# Altium schematic sheet J-Link Cortex with VCOM Adapter.SchDoc
size Letter; Address4: USA
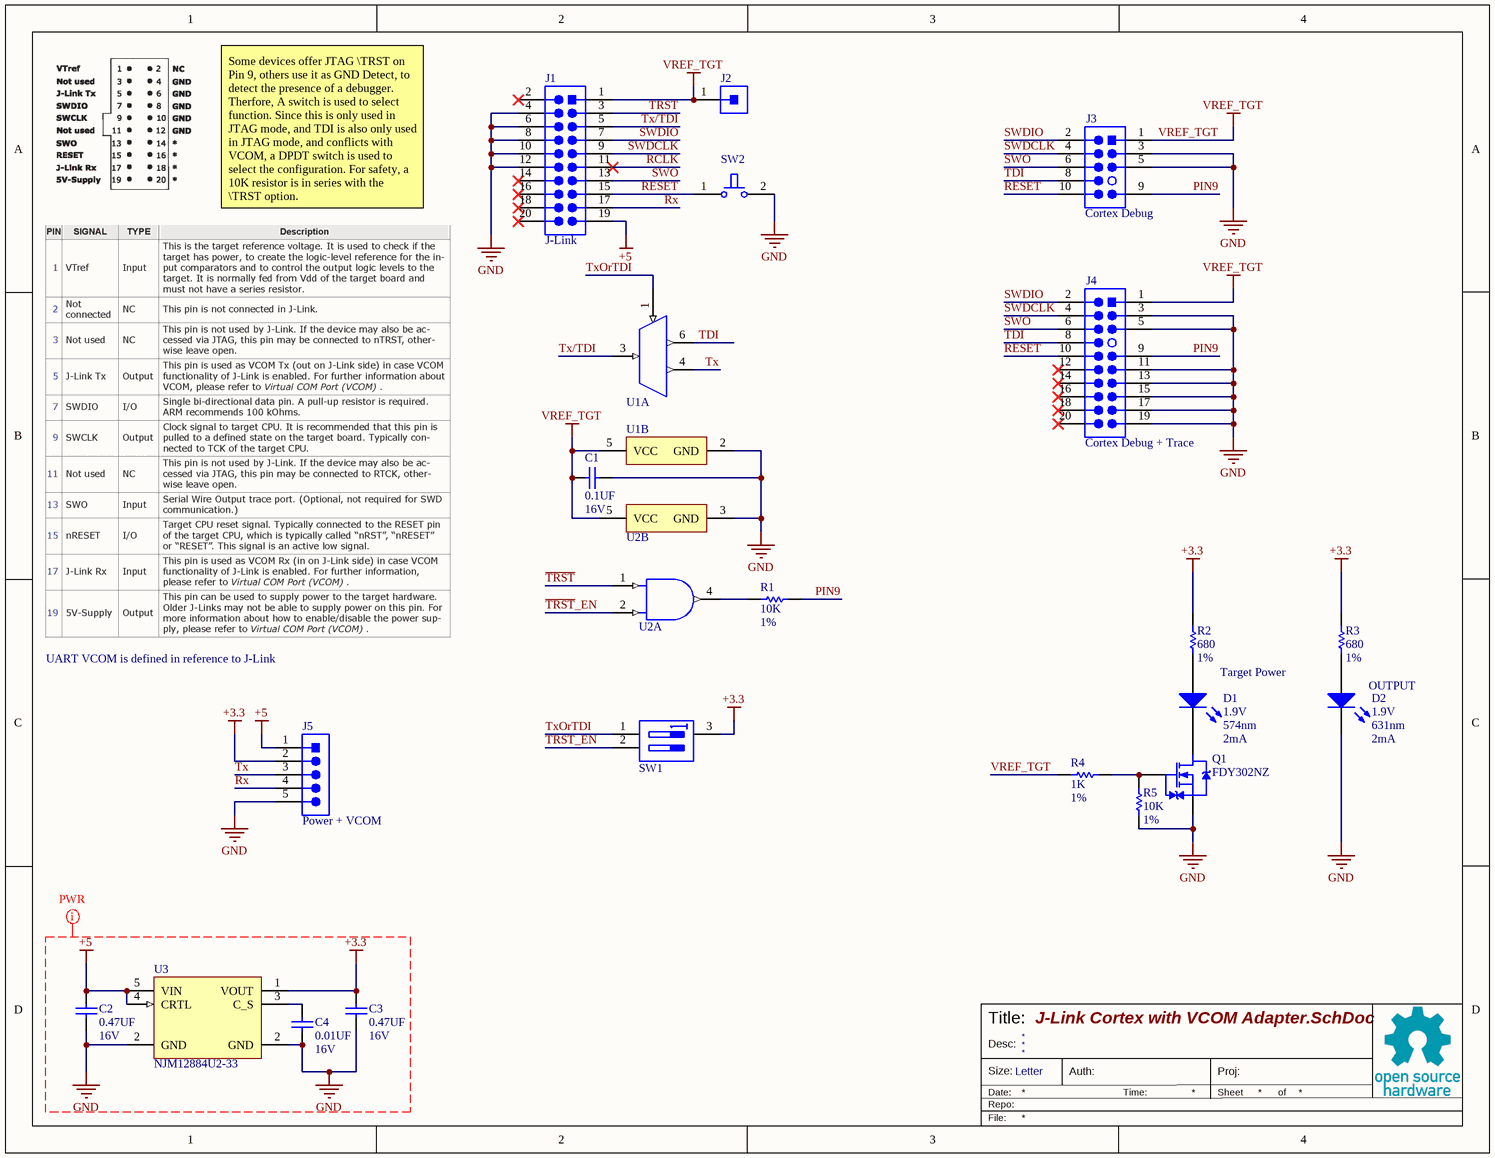
[diagram p0: J-Link Cortex with VCOM Adapter.SchDoc]

## Parts
C1  Val: 0.1UF  Vol: 16V  [0603_CAP]  (hidden comment: CAP 0603 0.1UF 16V 10% X7R)
C2  Val: 0.47UF  Vol: 16V  [0603_CAP]  (hidden comment: CAP 0603 0.47UF 16V 10% X7R)
C3  Val: 0.47UF  Vol: 16V  [0603_CAP]  (hidden comment: CAP 0603 0.47UF 16V 10% X7R)
C4  Val: 0.01UF  Vol: 16V  [0603_CAP]  (hidden comment: CAP 0603 0.01UF 16V 10% X7R)
D1  Voltage Rating: 1.9V  Wavelength: 574nm  Test Current: 2mA  [SM0805GCL]  (hidden comment: Green LED)
D2  Voltage Rating: 1.9V  Wavelength: 631nm  Test Current: 2mA  [SM0805HCL]  (hidden comment: Red LED)
J1  20 contact Female header, RA  [SFH11-PBPC-D10-RA-BK]  (value not drawn)
J2  1 contacts Male header  [PH1-01-UA round pad with connector]  (value not drawn)
J3  Cortex Debug, 0.050" 10 Pin  [FTSH-105-01-F-DV-007-K PLUGOUT]  (value not drawn)
J4  Cortex Debug+ETM Connector, 0.050" 20 Pin  [FTSH-110-01-F-DV-007-K plugout]  (value not drawn)
J5  5 contacts Male header  [70543-0109 - slim]  (value not drawn)
Q1  Manufacturer P/N: FDY302NZ  [SC89]  (hidden comment: N-Channel MOSFET)
R1  Val: 10K  Tol: 1%  [0603_RES]  (hidden comment: RES 0603 10K 1%)
R2  Val: 680  Tol: 1%  [0603_RES]  (hidden comment: RES 0603 680 1%)
R3  Val: 680  Tol: 1%  [0603_RES]  (hidden comment: RES 0603 680 1%)
R4  Val: 1K  Tol: 1%  [0603_RES]  (hidden comment: RES 0603 1K 1%)
R5  Val: 10K  Tol: 1%  [0603_RES]  (hidden comment: RES 0603 10K 1%)
SW1  SWITCH SLIDE DIP SPST 10MA 20V  [SPA02B]  (value not drawn)
SW2  SWITCH TACTILE SPST-NO 0.02A 15V  [EVP-BB2A9B000 LOW DENSITY]  (value not drawn)
U1  Demultiplexer  [SOT363]  (value not drawn)  (parts A,B of 2)
U2  Single AND Gate  [SOT353]  (value not drawn)  (parts A,B of 2)
U3  P/N: NJM12884U2-33  [SOT89-5_NJR]  (hidden comment: 3.3V LDO Soft start reverse current reverse voltage)

## Nets
+3.3: C3.2 J5.2 R2.2 R3.2 SW1.3(COM) U3.1(VOUT)
+5: C2.2 J1.19 J5.1 U3.4(CRTL) U3.5(VIN)
GND: C1.2 C2.1 C3.1 C4.1 D2.K J1.4 J1.6 J1.8 J1.10 J1.12 J3.3(GND) J3.5(GND) J4.3(GND) J4.5(GND) J4.11(GND/TgtPwr+Cap) J4.13 J4.15(GND) J4.17(GND) J4.19(GND) J5.5 Q1.2(S) R5.1 SW2.2 U1.2(GND) U2.3(GND) U3.2(GND)
VREF_TGT: C1.1 J1.1 J2.1 J3.1(VCC) J4.1(VCC) R4.1 U1.5(VCC) U2.5(VCC)
~{RESET}: J1.15 J3.10(~{RESET}) J4.10(~{RESET}) SW2.1
~{TRST}: J1.3 U2.1(A)
PIN9: J3.9(GNDDetect) J4.9(GNDDetect) R1.1
RCLK: J1.11
Rx: J1.17 J5.4
SWDCLK: J1.9 J3.4(SWDCLK/TCK) J4.4(SWDCLK/TCK)
SWDIO: J1.7 J3.2(SWDIO/TMS) J4.2(SWDIO/TMS)
SWO: J1.13 J3.6(SWO/TDO) J4.6(SWO/TDO/EXTa/TRACECTL)
~{TRST}_EN: SW1.2 U2.2(B)
TDI: J3.8(NC/TDI) J4.8(NC/EXTb/TDI) U1.6(Y0)
Tx: J5.3 U1.4(Y1)
Tx/TDI: J1.5 U1.3(A)
TxOrTDI: SW1.1 U1.1(S)
NetC4_2: C4.2 U3.3(C_S)
NetD1_A: D1.A R2.1
NetD1_K: D1.K Q1.3(D)
NetD2_A: D2.A R3.1
NetQ1_1: Q1.1(G) R4.2 R5.2
NetR1_2: R1.2 U2.4(Y)

Not connected (* = marked no-connect by the designer): J1 2* 14* 16* 18* 20*; J4 12(TRACECLK)* 14(TRACEDATA[0])* 16(TRACEDATA[1])* 18(TRACEDATA[2])* 20(TRACEDATA[3])*

## Layout directives
net class PWR: +3.3, +5, GND

## Notes on the sheet
- Some devices offer JTAG \TRST on Pin 9, others use it as GND Detect, to detect the presence of a debugger. Therfore, A switch is used to select function. Since this is only used in JTAG mode, and TDI is also only used in JTAG mode, and conflicts with VCOM, a DPDT switch is used to select the configuration. For safety, a 10K resistor is in series with the \TRST option.
- (near J3) Cortex Debug
- (near J1) J-Link
- (near J4) Cortex Debug + Trace
- UART VCOM is defined in reference to J-Link
- Target Power
- OUTPUT
- (near J5) Power + VCOM
- Title:
- Desc:
- Size:
- Date:
- File:
- Repo:
- Letter
- Auth:
- Time:
- Sheet
- Proj:
- of

## Library data of the parts
C1 = CAP 0603 0.1UF 16V 10% X7R: Capacitor Surface Mount 0603 Footprint 0.1UF 16V 10% Tolerance Ceramic X7R; Manufacturer: Various; PCB Package: 0603; Description in Visual: Cap SMT 0603 0.1UF 16V 10%  Cer X7R; P/N: CAP 0603 0.1UF 16V 10% X7R; Manufacturer P/N: Various; Value: 0.1UF; Voltage: 16V; Tolerance: 10%; Type: Ceramic X7R; ComponentLink1Description: Manufacturer Website; ComponentLink2Description: Component Datasheet; ComponentLink3Description: Octopart Link
C2 C3 = CAP 0603 0.47UF 16V 10% X7R: Capacitor Surface Mount 0603 Footprint 0.47UF 16V 10% Tolerance Ceramic X7R; Manufacturer: Various; PCB Package: 0603; Description in Visual: Cap SMT 0603 0.47UF 16V 10%  Cer X7R; P/N: CAP 0603 0.47UF 16V 10% X7R; Manufacturer P/N: Various; Value: 0.47UF; Voltage: 16V; Tolerance: 10%; Type: Ceramic X7R; ComponentLink1Description: Manufacturer Website; ComponentLink2Description: Component Datasheet; ComponentLink3Description: Octopart Link
C4 = CAP 0603 0.01UF 16V 10% X7R: Capacitor Surface Mount 0603 Footprint 0.01UF 16V 10% Tolerance Ceramic X7R; Manufacturer: Various; PCB Package: 0603; Description in Visual: Cap SMT 0603 0.01UF 16V 10%  Cer X7R; P/N: CAP 0603 0.01UF 16V 10% X7R; Manufacturer P/N: Various; Value: 0.01UF; Voltage: 16V; Tolerance: 10%; Type: Ceramic X7R; ComponentLink1Description: Manufacturer Website; ComponentLink2Description: Component Datasheet; ComponentLink3Description: Octopart Link
D1 = SM0805GCL: Green 574nm LED Indication - Discrete 1.9V 0805 (2012 Metric); Manufacturer: Bivar; PCB Package: 0805; Configuration: Single; Lens Style: Square; Millicandela Rating: 3.6mcd; Viewing Angle: 130°; Lens Type: Clear; Package Class: Surface Mount; P/N: SM0805GCL; Manufacturer P/N: SM0805GCL; Description in Visual: Green 574nm LED Indication - Discrete 1.9V 0805 (2012 Metric); Color: Green; ComponentLink1Description: Manufacturer Website; ComponentLink1URL: #https://www.bivar.com/#; ComponentLink2Description: Component Datasheet; ComponentLink2URL: https://www.bivar.com/parts_content/Datasheets/SM0805HCL.pdf; ComponentLink3Description: Octopart Link; ComponentLink3URL: #https://octopart.com/sm0805gcl-bivar-22059573?r=sp#
D2 = SM0805HCL: Red 631nm LED Indication - Discrete 1.9V 0805 (2012 Metric); Manufacturer: Bivar; PCB Package: 0805; Configuration: Single; Lens Style: Square; Millicandela Rating: 11.5mcd; Viewing Angle: 130°; Lens Type: Clear; Package Class: Surface Mount; P/N: SM0805HCL; Manufacturer P/N: SM0805HCL; Description in Visual: Red 631nm LED Indication - Discrete 1.9V 0805 (2012 Metric); Color: Red; ComponentLink1Description: Manufacturer Website; ComponentLink1URL: #https://www.bivar.com/#; ComponentLink2Description: Component Datasheet; ComponentLink2URL: https://www.bivar.com/parts_content/Datasheets/SM0805HCL.pdf; ComponentLink3Description: Octopart Link; ComponentLink3URL: #https://octopart.com/sm0805hcl-bivar-2191581?r=sp#
J1 = SFH11-PBPC-D10-RA-BK: 20 Position Header Connector  Through Hole, Right Angle; Manufacturer: Sullins; PCB Package: 2x10 THT; Description in Visual: Con Hdr Female 20 contacts horizontal 2X10 keyed; Number of Contacts: 20; Pitch: 0.100"; P/N: SFH11-PBPC-D10-RA-BK; Manufacturer P/N: SFH11-PBPC-D10-RA-BK; Orientation: horizontal; Number of Rows: 2; ComponentLink1Description: Manufacturer Website; ComponentLink1URL: https://www.sullinscorp.com/; ComponentLink2Description: Component Datasheet; ComponentLink2URL: https://datasheet.ciiva.com/754/sfh11-pxxc-dxx-ra-xx11161-c-754566.pdf?src-supplier=Digi-Key; Supplier 1: Digi-Key; Supplier Part Number 1: S9205-ND
J2 = PH1-01-UA: Connector Male Header 1X1 vertical 1contact 0.100in pitch Gold finish TH; Manufacturer: Adam Tech; PCB Package: NON-STD TH; Description in Visual: Con Hdr Male 1contacts vertical 1X1; Number of Contacts: 1; P/N: PH1-01-UA; Manufacturer P/N: PH1-01-UA; Orientation: vertical; Number of Rows: 1; Pitch: 0.100in; Contact Finish: Gold Flash; Gender: Male; ComponentLink1Description: Manufacturer Website; ComponentLink1URL: http://www.adam-tech.com/; ComponentLink2Description: Component Datasheet; ComponentLink2URL: http://www.adam-tech.com/downloader.php?p=PH1-XX-UA.pdf; ComponentLink3Description: Octopart Link; ComponentLink3URL: https://octopart.com/ph1-01-ua-adam+tech-12701205?r=sp; Supplier 1: Digi-Key; Supplier Part Number 1: 2057-PH1-01-UA-ND
J3 = ARM Cortex Debug: 10 Pin Shrouded Header, 0.050", Key Pin 7; Manufacturer: Samtech; Manufacturer P/N: Various; Number of Contacts: 10; Gender: Male; P/N: ARM Cortex Debug; Description in Visual: 10 Pin Shrouded Header, 0.050", Key Pin 7; Orientation: Vertical; Number of Rows: 2; Pitch: 0.050"; Contact Finish: Gold; ComponentLink1Description: Pinout Reference; ComponentLink1URL: http://infocenter.arm.com/help/topic/com.arm.doc.faqs/attached/13634/cortex_debug_connectors.pdf; Supplier 3: Digi-Key; Supplier Part Number 3: SAM11250-ND; Supplier 1: Digi-Key; Supplier Part Number 1: SAM15640-ND; Supplier 2: Digi-Key; Supplier Part Number 2: SAM13926CT-ND; ComponentLink2Description: Datasheet for Connector; ComponentLink2URL: http://suddendocs.samtec.com/catalog_english/ftsh_smt.pdf
J4 = Cortex Debug+ETM: 20 Pin Shrouded Header, 0.050", Key Pin 7; Manufacturer: Samtech; Manufacturer P/N: Various; Number of Contacts: 20; Gender: Male; P/N: Cortex Debug+ETM; Description in Visual: 20 Pin Shrouded Header, 0.050", Key Pin 7; Orientation: Vertical; Number of Rows: 2; Pitch: 0.050"; Contact Finish: Gold; ComponentLink1Description: Pinout Reference; ComponentLink1URL: http://infocenter.arm.com/help/topic/com.arm.doc.faqs/attached/13634/cortex_debug_connectors.pdf; Supplier 3: Digi-Key; Supplier Part Number 3: SAM11264-ND; Supplier 4: Avnet; Supplier Part Number 4: FTSH-110-01-F-DV-007-K-A; Supplier 1: Digi-Key; Supplier Part Number 1: SAM15422CT-ND; Supplier 2: Avnet; Supplier Part Number 2: FTSH-110-01-F-DV-007-K-TR; ComponentLink2Description: Datasheet for Connector; ComponentLink2URL: http://suddendocs.samtec.com/catalog_english/ftsh_smt.pdf
J5 = 70543-0109: Connector Male Header 1X5 vertical 5contacts 0.100in pitch 0.76um Gold finish shrouded with latch; Manufacturer: Molex; PCB Package: NON-STD TH; Description in Visual: Con Hdr Male 5contacts vertical 1X5; Number of Contacts: 5; P/N: 70543-0109; Manufacturer P/N: 70543-0109; Orientation: vertical; Number of Rows: 1.00; Pitch: 0.100in; Contact Finish: 0.76um Gold; Gender: Male; Options: shrouded with latch; ComponentLink1Description: Manufacturer Website; ComponentLink1URL: http://www.molex.com; ComponentLink2Description: Component Datasheet; ComponentLink2URL: http://www.molex.com/pdm_docs/sd/705430106_sd.pdf; ComponentLink4Description: Product Page; ComponentLink4URL: http://www.molex.com/molex/products/datasheet.jsp?part=active/0705430109_PCB_HEADERS.xml; ComponentLink3Description: Octopart Link; ComponentLink3URL: http://octopart.com/partsearch/#search/requestData&q=70543-0109; Supplier 1: Digi-Key; Supplier Part Number 1: WM4125-ND
Q1 = FDY302NZ: N-Channel 20V 600mA (Ta) 625mW (Ta) Surface Mount SC-89; Manufacturer: On Semiconductor; Vdss (V): 20; RDSon (mOhms): 300; ID (Amps): 0.6; Rth(JC) (K/W): 280; P/N: FDY302NZ; PCB Package: SC-89; Description in Visual: N-Channel 20V 600mA (Ta) 625mW (Ta) Surface Mount SC-89; Family: FDY30; Package Class: Surface Mount; ComponentLink1Description: Manufacturer Website; ComponentLink1URL: #https://www.onsemi.com#; ComponentLink2Description: Component Datasheet; ComponentLink2URL: https://www.onsemi.com/pub/Collateral/FDY302NZ-D.pdf; ComponentLink4Description: Product Page; ComponentLink4URL: https://www.onsemi.com/products/discretes-drivers/mosfets/fdy302nz; ComponentLink3Description: Octopart Link; ComponentLink3URL: #https://octopart.com/fdy302nz-on+semiconductor-84326732?r=sp#; Supplier 1: Digi-Key; Supplier Part Number 1: FDY302NZCT-ND
R1 R5 = RES 0603 10K 1%: Resistor Surface Mount, 10K Ohms, 0603 Footprint, 1% Tolerance 0.1W; Manufacturer: Various; PCB Package: 0603; Description in Visual: Res SMT 10K 0603  1%  0.1W; P/N: RES 0603 10K 1%; Manufacturer P/N: Various; Value: 10K; Power_Rating: 0.1W; Tolerance: 1%; Supplier 1: Digi-Key; Supplier Part Number 1: P10.0KHCT-ND; Supplier 2: Digi-Key; Supplier Part Number 2: 541-10.0KHCT-ND; Supplier 3: Newark; Supplier Part Number 3: 68R0128; Supplier 4: Digi-Key; Supplier Part Number 4: A106048CT-ND
R2 R3 = RES 0603 680 1%: Resistor Surface Mount, 680 Ohms, 0603 Footprint, 1% Tolerance 0.1W; Manufacturer: Various; PCB Package: 0603; Description in Visual: Res SMT 680 0603  1%  0.1W; Value: 680; P/N: RES 0603 680 1%; Manufacturer P/N: Various; Power_Rating: 0.1W; Tolerance: 1%; Supplier 1: Digi-Key; Supplier Part Number 1: 541-680HCT-ND; Supplier 2: Digi-Key; Supplier Part Number 2: 2019-RK73H1JTTD6800FCT-ND; Supplier 3: Digi-Key; Supplier Part Number 3: P680HCT-ND; Supplier 4: Digi-Key; Supplier Part Number 4: YAG3356CT-ND
R4 = RES 0603 1K 1%: Resistor Surface Mount, 1K Ohms, 0603 Footprint, 1% Tolerance 0.1W; Manufacturer: Various; PCB Package: 0603; Description in Visual: Res SMT 1K 0603  1%  0.1W; P/N: RES 0603 1K 1%; Manufacturer P/N: Various; Value: 1K; Power_Rating: 0.1W; Tolerance: 1%; Supplier 1: Digi-Key; Supplier Part Number 1: 2019-RK73H1JTTD1001FCT-ND; Supplier 2: Digi-Key; Supplier Part Number 2: 541-1166-1-ND; Supplier 3: RSComponents; Supplier Part Number 3: 1051155; Supplier 4: Digi-Key; Supplier Part Number 4: 311-1.00KHRCT-ND
SW1 = SPA02B: Dip Switch SPST 2 Position Through Hole Slide (Standard) Actuator 10mA 20VDC, Commoned; Manufacturer: C&K; Number of Switches: 2; Mechanical Life: 1,000 Cycles; Electrical Life: 1000 Cycles; Throw Configuration: 2xSPST; Switch Function: Off-On (Common); Actuator Height: Flush/Recessed; P/N: SPA02B; Type: DIP; Rated Current (A): 10mA; Rated Voltage (V): 20VDC; Temperature Range: -30°C ~ 60°C; Mounting Style: Through Hole; Contact Material: Beryllium Copper. Gold Finish; ComponentLink1Description: Manufacturer's Website; ComponentLink1URL: https://www.ckswitches.com/; ComponentLink2Description: Component Datasheet; ComponentLink2URL: https://www.ckswitches.com/media/1325/spa.pdf; ComponentLink4Description: Octopart Link; ComponentLink4URL: https://octopart.com/spa02b-c%26k+components-7950389?r=sp; Supplier 1: Digi-Key; Supplier Part Number 1: CKN9438-ND; Manufacturer P/N: SPA02B
SW2 = EVP-BB2A9B000: Tactile Switch SPST-NO Top Actuated Surface Mount; Manufacturer: Panasonic Electronic Components; Number of Switches: 1; Rated Current (A): 20mA; Rated Voltage (V): 15VDC; Mechanical Life: 500,000 Cycles; Switch Function: Off-Mom; Actuator Height: 0.53mm; Actuation Force: 160gf; P/N: EVP-BB2A9B000; Manufacturer P/N: EVP-BB2A9B000; Type: Tactile; Temperature Range: -40°C ~ 85°C; Mounting Style: SMD; Throw Configuration: SPST-NO; ComponentLink1Description: Manufacturer's Website; ComponentLink1URL: https://na.industrial.panasonic.com/; ComponentLink2Description: Component Datasheet; ComponentLink2URL: https://www3.panasonic.biz/ac/e_download/control/switch/light-touch/catalog/sw_lt_eng_2616s.pdf; ComponentLink4Description: Octopart Link; ComponentLink4URL: https://octopart.com/evp-bb2a9b000-panasonic-75477754?r=sp; Supplier 1: Digi-Key; Supplier Part Number 1: P19888CT-ND
U1 = SN74LVC1G18DCK: Single 1-of-2 Non-Inverting Demultiplexer with 3-State Deselected Output SC70-6; Manufacturer: Texas Instruments; Description in Visual: Logic IC SMT Non-Inverting Demux SC70-6; Number of Gates: 1; Vs (min) (V): 1.65; Vs (max) (V): 5.5; Temp Range: -40 to +85 °C; P/N: SN74LVC1G18DCK; Manufacturer P/N: SN74LVC1G18DCK; Type: Demux; PCB Package: SC70-6; ComponentLink1Description: Manufacturer Website; ComponentLink1URL: http://www.ti.com; ComponentLink2Description: Component Datasheet; ComponentLink3Description: Octopart Link; ComponentLink3URL: http://octopart.com/partsearch/#search/requestData&q=SN74LVC1G18DCK; Supplier 1: Digi-Key; Supplier Part Number 1: 296-15569-1-ND
U2 = SN74LVC1G08DCKR: Single Positive-AND Gate SMT 2-Input SOT-353; Manufacturer: Texas Instruments; Description in Visual: Logic IC SMT Single AND Gate SOT-353; Number of Gates: 1; Number of Gate Inputs: 2; Vs (min) (V): 1.65; Vs (max) (V): 5.5; Quiescent Current (typ) (mA): 0.010; Temp Range: -40 to +125 °C; P/N: SN74LVC1G08DCKR; Manufacturer P/N: SN74LVC1G08DCKR; Type: AND; PCB Package: SOT353; ComponentLink1Description: Manufacturer Website; ComponentLink1URL: http://www.ti.com; ComponentLink2Description: Component Datasheet; ComponentLink2URL: https://www.ti.com/lit/ds/symlink/sn74lvc1g08.pdf; ComponentLink3Description: Octopart Link; ComponentLink3URL: #https://octopart.com/sn74lvc1g08dckr-texas+instruments-464430?r=sp#; Supplier 1: Digi-Key; Supplier Part Number 1: 296-11602-1-ND
U3 = NJM12884U2-33: Linear Voltage Regulator IC  1 Output  500mA SOT-89-5; Manufacturer: NJR Corporation/NJRC; Manufacturer P/N: NJM12884U2-33-TE1; Vin Min (Volts): 3.48; Vin Max (Volts): 6.5; Quiescent Current (mA): 0.280; Initial Error: ±1%; PCB Package: SOT89-5-2; Layout Considerations: Schottky barrier diode is not needed; CIN ≥ 0.33μF; COUT ≥ 0.47μF; Description in Visual: Linear Voltage Regulator IC  1 Output  500mA SOT-89-5; Type: LDO; Features: Control, Soft-start, Discharge, Thermal Shutdown, Over-current, Reverse current; Output Voltage (Volts): 3.3V; Temperature Range: -40°C - 125°C; ComponentLink1Description: Manufacturer's Website; ComponentLink2Description: Component Datasheet; ComponentLink2URL: https://www.njr.com/semicon/PDF/NJM12884_E.pdf; ComponentLink3Description: Octopart Link; ComponentLink3URL: #https://octopart.com/njm12884u2-33-te1-new+japan+radio-92406224?r=sp#; Supplier 1: Digi-Key; Supplier Part Number 1: 190-NJM12884U2-33-TE1CT-ND; ComponentLink1URL: #https://www.njr.com/#